# EAGLE design Common_Bluetooth_Control (EAGLE 7.2.0)
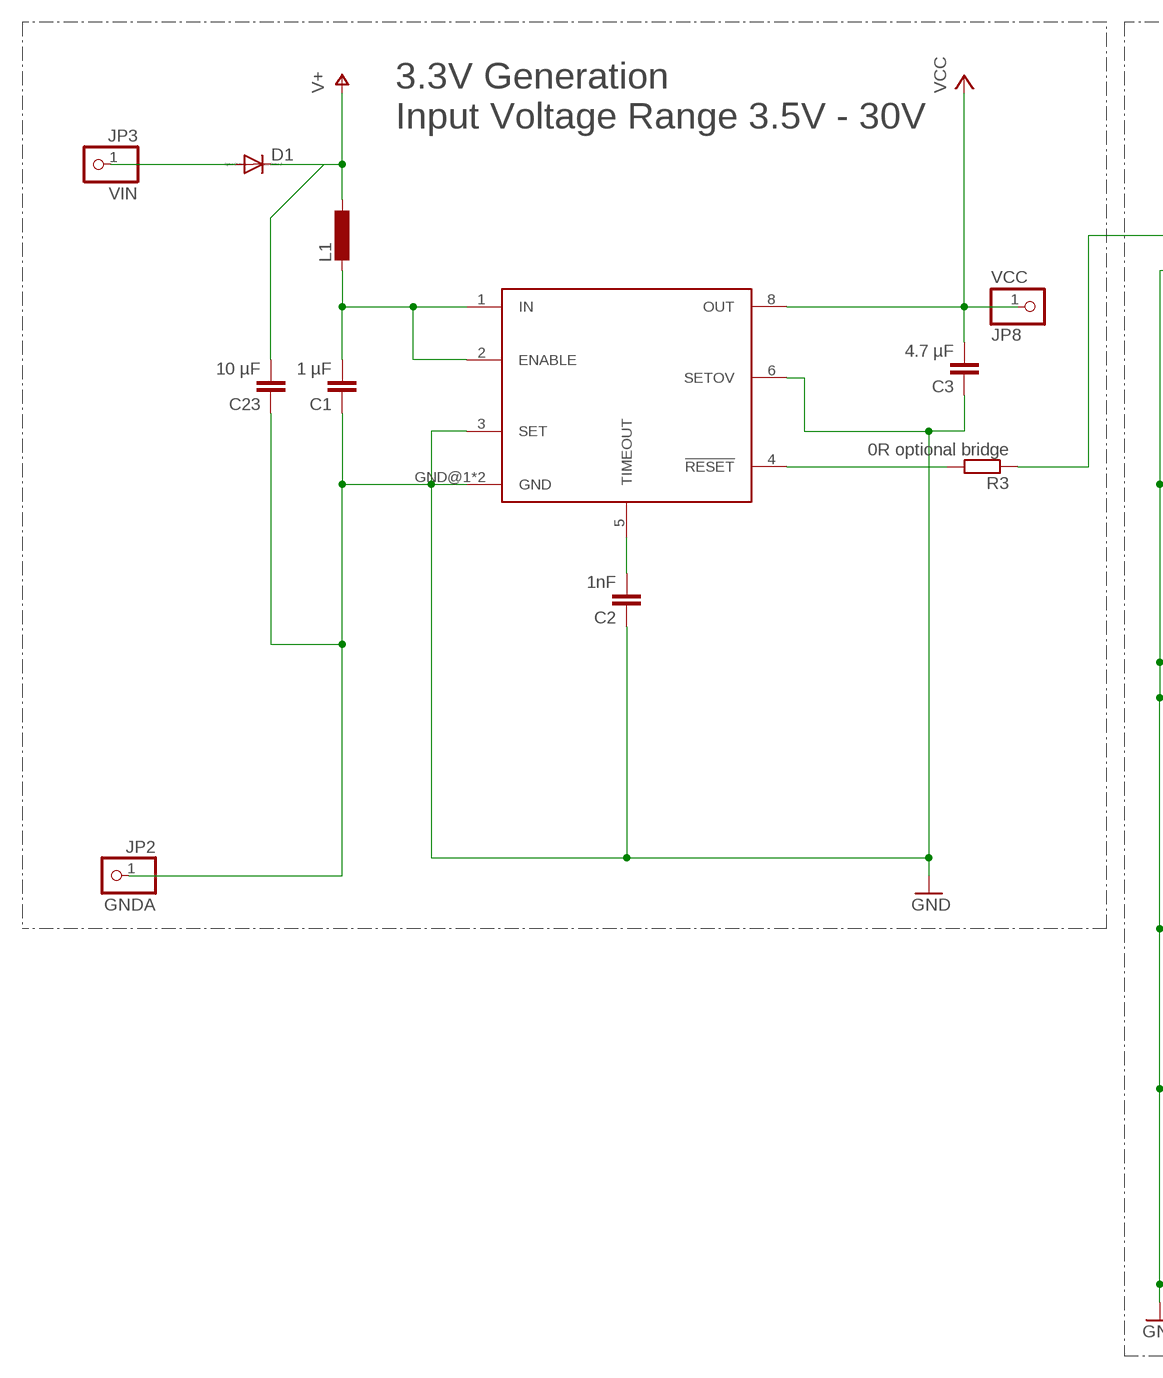
[diagram p0: schematic, sheet 1, part 1 of 2]
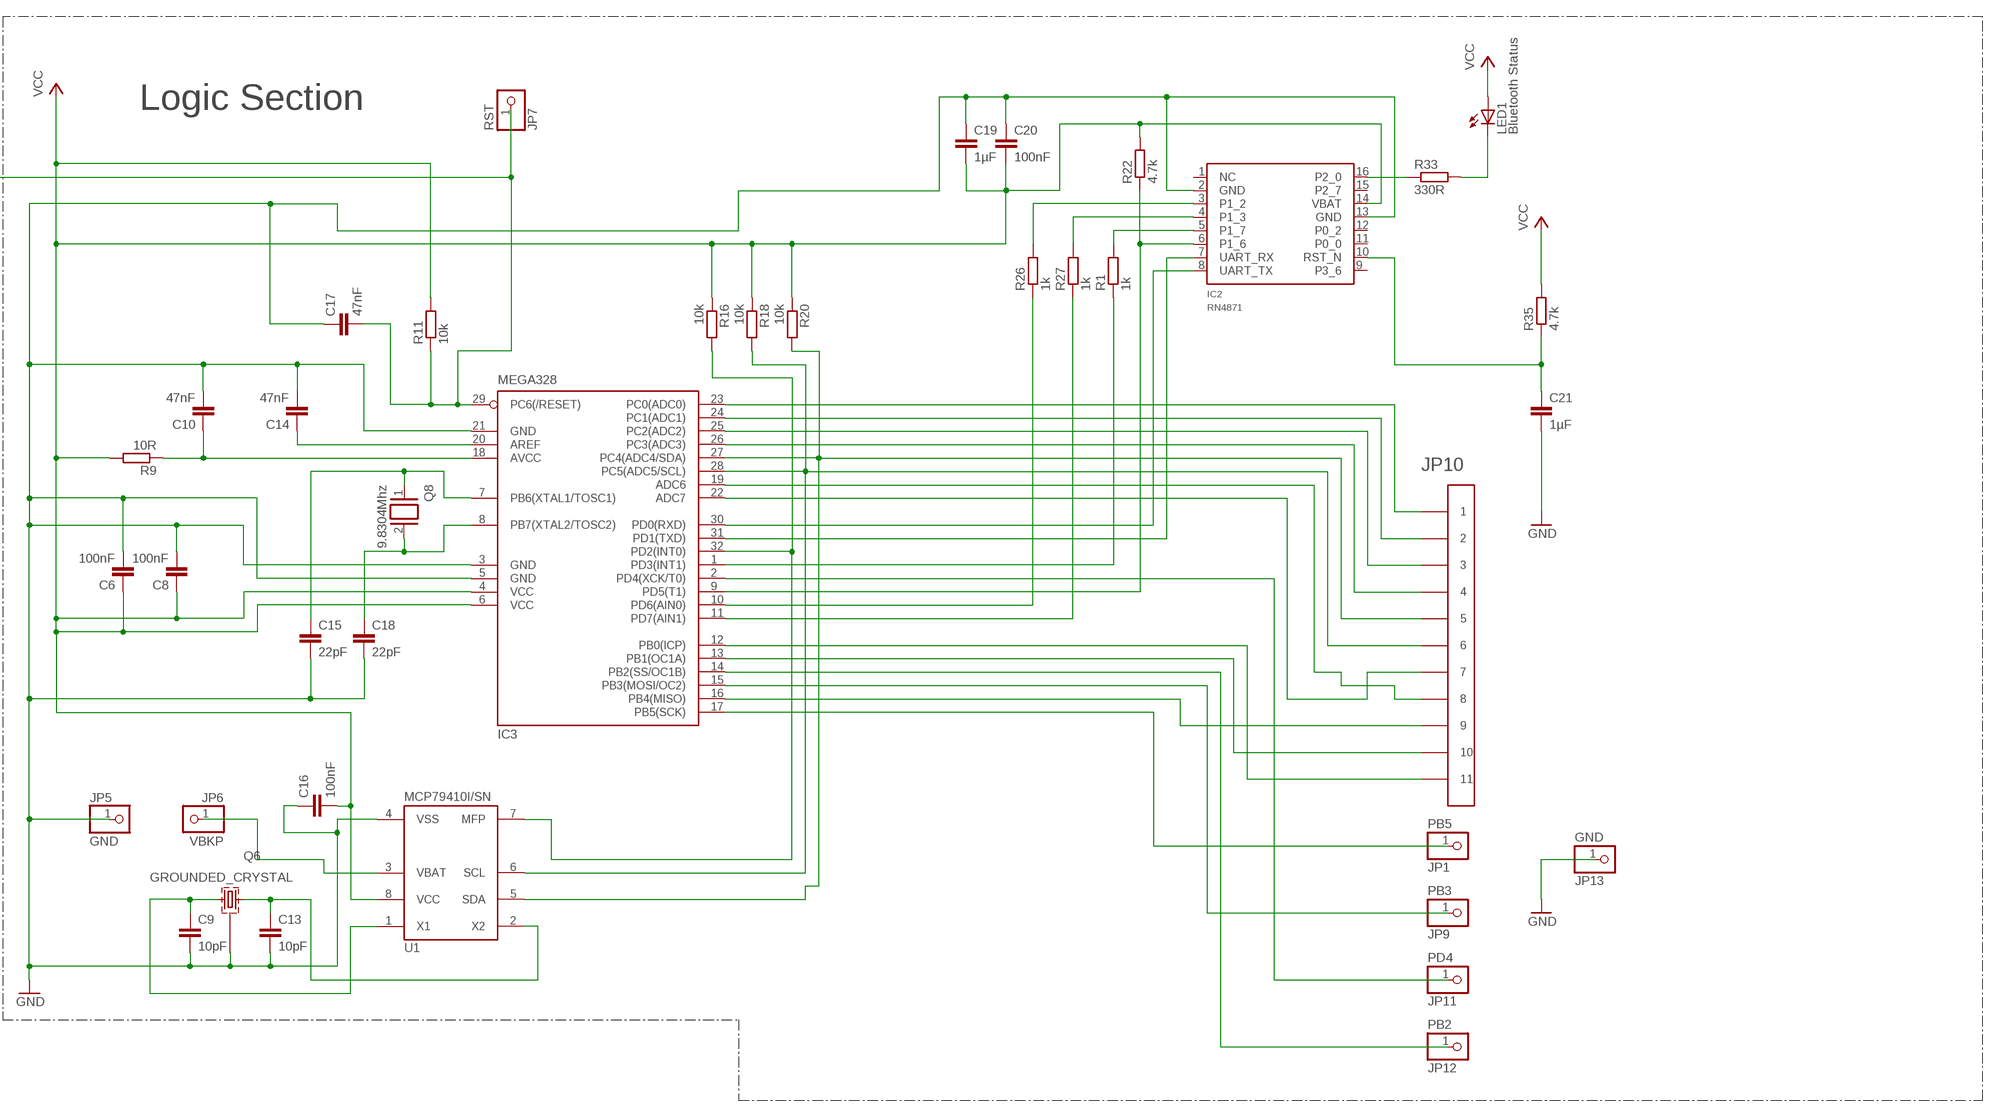
[diagram p1: schematic, sheet 1, part 2 of 2]

## Parts
C1  1 µF  C-EUC1206  [C1206]
C2  1nF  C-EUC0603  [C0603]
C3  4.7 µF  C-EUC1206  [C1206]
C6  100nF  C-EUC0603  [C0603]
C8  100nF  C-EUC0603K  [C0603K]
C9  10pF  C-EUC0603  [C0603]
C10  47nF  C-EUC0603  [C0603]
C13  10pF  C-EUC0603  [C0603]
C14  47nF  C-EUC0603  [C0603]
C15  22pF  C-EUC0805  [C0805]
C16  100nF  C-EUC0603  [C0603]
C17  47nF  C-EUC0603  [C0603]
C18  22pF  C-EUC0805  [C0805]
C19  1µF  C-EUC0603  [C0603]
C20  100nF  C-EUC0603  [C0603]
C21  1µF  C-EUC0603  [C0603]
C23  10 µF  C-EUC1206  [C1206]
D1  DIODE-DO214AC  [DO214AC]
IC1  MAX16910  [SO08]
IC2  RN4871  [RN4871]
IC3  MEGA328  MEGA8-AI  [TQFP32-08]
JP1  PB5  PINHD-1X1  [1X01]
JP2  GNDA  PINHD-1X1  [1X01]
JP3  VIN  PINHD-1X1  [1X01]
JP5  GND  PINHD-1X1  [1X01]
JP6  VBKP  PINHD-1X1  [1X01]
JP7  RST  PINHD-1X1  [1X01]
JP8  VCC  PINHD-1X1  [1X01]
JP9  PB3  PINHD-1X1  [1X01]
JP10  PINHD-1X11-OCT  [1X11_OCT]
JP11  PD4  PINHD-1X1  [1X01]
JP12  PB2  PINHD-1X1  [1X01]
JP13  GND  PINHD-1X1  [1X01]
L1  L-EUL0805  [R0805]
LED1  Bluetooth Status  LEDCHIPLED_0603  [CHIPLED_0603]
Q6  GROUNDED_CRYSTAL  [MS3V-7]
Q8  9.8304Mhz  XTAL/S  [QS]
R1  1k  R-EU_R0603  [R0603]
R3  0R optional bridge  R-EU_R0603  [R0603]
R9  10R  R-EU_R0603  [R0603]
R11  10k  R-EU_R0603  [R0603]
R16  10k  R-EU_R0603  [R0603]
R18  10k  R-EU_R0603  [R0603]
R20  10k  R-EU_R0603  [R0603]
R22  4.7k  R-EU_R0603  [R0603]
R26  1k  R-EU_R0603  [R0603]
R27  1k  R-EU_R0603  [R0603]
R33  330R  R-EU_R0603  [R0603]
R35  4.7k  R-EU_R0603  [R0603]
U1  MCP79410I/SN  [SO8]

## Nets
GND: C1.1 C2.1 C3.1 C6.2 C8.2 C9.2 C10.2 C13.2 C14.2 C15.2 C16.1 C17.1 C18.2 C19.1 C20.1 C21.2 C23.1 IC1.3(SET) IC1.6(SETOV) IC1.GND@1(GND) IC1.GND@2(GND) IC2.2(GND) IC2.13(GND) IC3.3(GND) IC3.5(GND) IC3.21(GND) JP2.1 JP5.1 JP13.1 Q6.GND U1.4(VSS)
N$1: C13.1 Q6.X2 U1.2(X2)
N$2: C21.1 IC2.10(RST_N) R35.1
N$3: IC2.16(P2_0) R33.1
N$4: IC3.32(PD2(INT0)) R16.2 U1.7(MFP)
N$5: C9.1 Q6.X1 U1.1(X1)
N$6: IC2.3(P1_2) R26.2
N$7: LED1.C R33.2
N$8: IC2.8(UART_TX) IC3.30(PD0(RXD))
N$9: IC2.7(UART_RX) IC3.31(PD1(TXD))
N$10: D1.A JP3.1
N$11: C10.1 IC3.18(AVCC) R9.1
N$12: IC3.16(PB4(MISO)) JP10.9
N$13: C14.1 IC3.20(AREF)
N$14: C15.1 IC3.7(PB6(XTAL1/TOSC1)) Q8.1
N$15: JP6.1 U1.3(VBAT)
N$16: C18.1 IC3.8(PB7(XTAL2/TOSC2)) Q8.2
N$17: IC2.4(P1_3) R27.2
N$18: IC3.17(PB5(SCK)) JP1.1
N$19: IC3.11(PD7(AIN1)) R27.1
N$20: IC3.10(PD6(AIN0)) R26.1
N$21: IC2.6(P1_6) IC3.9(PD5(T1)) R22.1
N$22: IC3.28(PC5(ADC5/SCL)) JP10.1 R18.2 U1.6(SCL)
N$23: IC3.27(PC4(ADC4/SDA)) JP10.2 R20.2 U1.5(SDA)
N$24: IC2.5(P1_7) R1.2
N$25: IC3.1(PD3(INT1)) R1.1
N$26: IC3.23(PC0(ADC0)) JP10.5
N$27: IC3.24(PC1(ADC1)) JP10.6
N$28: IC3.25(PC2(ADC2)) JP10.4
N$29: IC3.26(PC3(ADC3)) JP10.3
N$30: IC3.19(ADC6) JP10.8
N$31: IC3.22(ADC7) JP10.7
N$32: IC3.2(PD4(XCK/T0)) JP11.1
N$33: IC3.12(PB0(ICP)) JP10.11
N$34: IC3.13(PB1(OC1A)) JP10.10
N$35: IC3.14(PB2(SS/OC1B)) JP12.1
N$36: C2.2 IC1.5(TIMEOUT)
N$40: IC1.4(!RESET!) R3.2
N$48: C1.2 IC1.1(IN) IC1.2(ENABLE) L1.2
N$80: IC3.15(PB3(MOSI/OC2)) JP9.1
N$86: C17.2 IC3.29(PC6(/RESET)) JP7.1 R3.1 R11.1
V+: C23.2 D1.C L1.1
VCC: C3.2 C6.1 C8.1 C16.2 C19.2 C20.2 IC1.8(OUT) IC2.14(VBAT) IC3.4(VCC) IC3.6(VCC) JP8.1 LED1.A R9.2 R11.2 R16.1 R18.1 R20.1 R22.2 R35.2 U1.8(VCC)
Unconnected: IC2.1(NC) IC2.9(P3_6) IC2.11(P0_0) IC2.12(P0_2) IC2.15(P2_7)

## Notes on the sheet
- Logic Section
- 3.3V Generation
  Input Voltage Range 3.5V - 30V

## Library data of the parts
C1-C3 C6 C8-C10 C13-C21 C23 = resistor:C-EU: CAPACITOR, European symbol
D1 = diode:DIODE-: DIODE
IC1 = max16910:MAX16910: Maxim Integrated MAX16910 Ultra-LowQuiescent Current, Linear Regulator
IC2 = RN4871:RN4871
IC3 = atmel:MEGA8: MICROCONTROLLER 8 Kbytes FLASH, 1 kbytes SRAM, 512 bytes EEPROM, USART, 6-channel 10 bit ADC, 2-channel 8 bit ADC Pin compatible with Atmega48, ATMega88, ATMega168 Source: avr.lbr; MPN: ATMEGA8-16AU; OC_FARNELL: 9171371; OC_NEWARK: 73M8863
JP1-JP3 JP5-JP9 JP11-JP13 = pinhead:PINHD-1X1: PIN HEADER
JP10 = pinheadX:PINHD-1X11-OCT
L1 = Inductance special:L-EU: INDUCTOR, European symbol
LED1 = led:LED: LED OSRAM: - CHIPLED LG R971, LG N971, LY N971, LG Q971, LY Q971, LO R971, LY R971 LH N974, LH R974 LS Q976, LO Q976, LY Q976 LO Q996 - Hyper CHIPLED LW Q18S LB Q993, LB Q99A, LB R99A - SideLED LS A670, LO A670, LY A670, LG A670, LP A670 LB A673, LV A673, LT A673, LW A673 LH A674 LY A675 LS A676, LA A676, LO A676, LY A676, LW A676 LS A679, LY A679, LG A679 - Hyper Micro SIDELED® LS Y876, LA Y876, LO Y876, LY Y876 LT Y87S - SmartLED LW L88C, LW L88S LB L89C, LB L89S, LG L890 LS L89K, LO L89K, LY L89K LS L896, LA L896, LO L896, LY L896 - TOPLED LS T670, LO T670, LY T670, LG T670, LP T670 LSG T670, LSP T670, LSY T670, LOP T670, LYG T670 LG T671, LOG T671, LSG T671 LB T673, LV T673, LT T673, LW T673 LH T674 LS T676, LA T676, LO T676, LY T676, LB T676, LH T676, LSB T676, LW T676 LB T67C, LV T67C, LT T67C, LS T67K, LO T67K, LY T67K, LW E67C LS E67B, LA E67B, LO E67B, LY E67B, LB E67C, LV E67C, LT E67C LW T67C LS T679, LY T679, LG T679 LS T770, LO T770, LY T770, LG T770, LP T770 LB T773, LV T773, LT T773, LW T773 LH T774 LS E675, LA E675, LY E675, LS T675 LS T776, LA T776, LO T776, LY T776, LB T776 LHGB T686 LT T68C, LB T68C - Hyper Mini TOPLED® LB M676 - Mini TOPLED Santana® LG M470 LS M47K, LO M47K, LY M47K Source: http://www.osram.convergy.de LUXEON: - LUMILED® LXK2-PW12-R00, LXK2-PW12-S00, LXK2-PW14-U00, LXK2-PW14-V00 LXK2-PM12-R00, LXK2-PM12-S00, LXK2-PM14-U00 LXK2-PE12-Q00, LXK2-PE12-R00, LXK2-PE12-S00, LXK2-PE14-T00, LXK2-PE14-U00 LXK2-PB12-K00, LXK2-PB12-L00, LXK2-PB12-M00, LXK2-PB14-N00, LXK2-PB14-P00, LXK2-PB14-Q00 LXK2-PR12-L00, LXK2-PR12-M00, LXK2-PR14-Q00, LXK2-PR14-R00 LXK2-PD12-Q00, LXK2-PD12-R00, LXK2-PD12-S00 LXK2-PH12-R00, LXK2-PH12-S00 LXK2-PL12-P00, LXK2-PL12-Q00, LXK2-PL12-R00 Source: www.luxeon.com KINGBRIGHT: KA-3528ASYC Source: www.kingbright.com
Q6 = crystal:GROUNDED_CRYSTAL
Q8 = special:XTAL/S: CRYSTAL
R1 R3 R9 R11 R16 R18 R20 R22 R26 R27 R33 R35 = resistor:R-EU_: RESISTOR, European symbol
U1 = _hhn_MCP7941X:MCP7941*?: Microchip MCP79410 / MCP79411 / MCP79412 I²C Real Time CLock/Calendar with Unique ID Rev. 5.0.0 as of 2013-10-23, for EAGLE 5+ Changelog 5.0.0 (initial) MCP79410XI/YY X: Unique ID 0: blank 1: EUI-48 2: EUI-96 I: Temperature Range (Industrial) /YY: Package /MS: MSOP8_.65 (8-Lead Micro Small Outline Package, 0.65mm pitch) /SN: SOIC8 (8-Lead Small Outline [Narrow], 3.9mm body) /ST: TSSOP8 (8-Lead Thin Schrink Small Outline, 4.4mm body) Source: http://www.microchip.com Author: Dipl.-Ing. FH Rainer Bayer Heilbronn University HHN http://www.hs-heilbronn.de/rainer.bayer · rainer.bayer@hs-heilbronn.de Engineering office ing-rb: http://www.ing-rb.de/ · eagle@ing-rb.de Lectureship dozent-rb: http://www.dozent-rb.de/ · eagle@dozent-rb.de

## Board
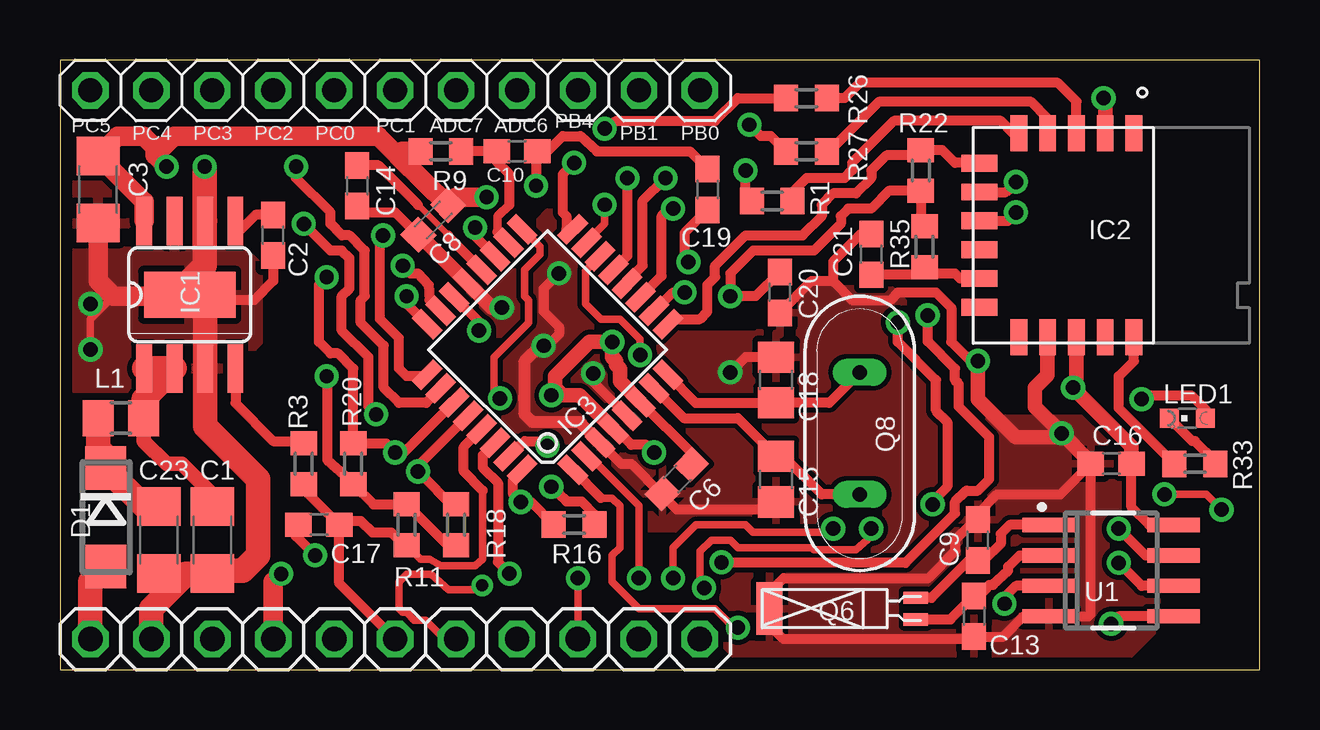
[diagram p2: board, top side]
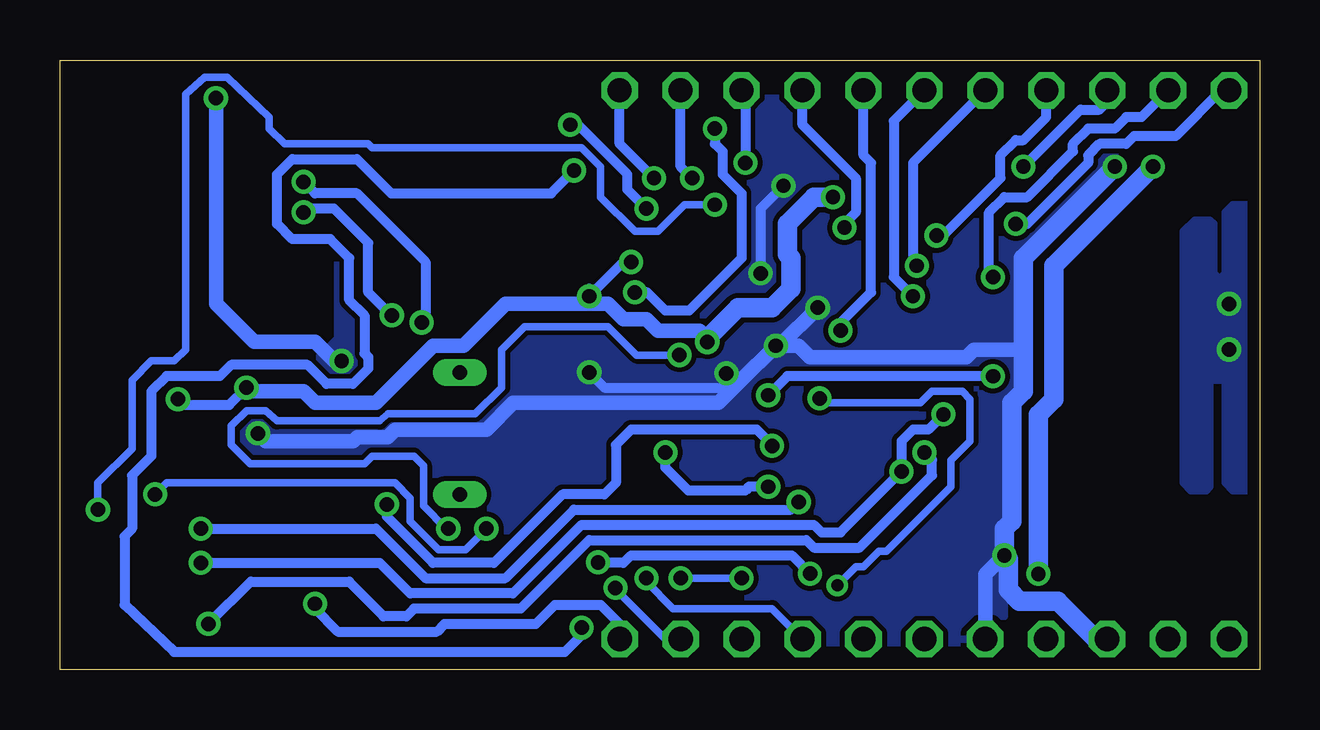
[diagram p3: board, bottom side, seen from below]

Size 50 x 25.4 mm. Coordinates in mm from the lower left corner, seen from the top.
Outline: 0,0 50,0 50,25.4 0,25.4 0,0
Copper layers (1*16): Top 0.035mm / dielectric 1.5mm / Bottom 0.035mm
Design rules "default *": minimum track width 10mil, minimum drill 19mil, track to track 8mil, track to pad 8mil, pad to pad 8mil, via to via 8mil, smd to smd 8mil, copper to edge 20mil, drill to drill 8mil, minimum pad ring 10mil, minimum via ring 8mil, stop-mask expansion 4mil, vias tented up to drill 0mil, thermal gap 10mil

### Footprints (pad centres in the part's own frame; a part is rotated, then mirrored left to right if it is on the bottom)
C1206 = smd 1.6 x 1.8: 1 -1.4,0; 2 1.4,0
C0603 = smd 1.1 x 1: 1 -0.85,0; 2 0.85,0
C0603K = smd 1.05 x 1.08: 1 -0.875,0; 2 0.875,0
C0805 = smd 1.3 x 1.5: 1 -0.95,0; 2 0.95,0
DO214AC = smd 1.8 x 1.7: A 2.05,0; C -2.05,0
SO08 = smd 0.66 x 2.032: 1 -1.905,-3.073; 2 -0.635,-3.073; 3 0.635,-3.073; 4 1.905,-3.073; 5 1.905,3.073; 6 0.635,3.073; 8 -1.905,3.073; GND@1 -0.635,3.073 | smd 3.81 x 1.93: GND@2 0,0
RN4871 = smd 1.5 x 0.7: 1 -4.25,0.95; 2 -4.25,-0.25; 3 -4.25,-1.45; 4 -4.25,-2.65; 5 -4.25,-3.85; 12 4.25,-3.85; 13 4.25,-2.65; 14 4.25,-1.45; 15 4.25,-0.25; 16 4.25,0.95 | smd 0.7 x 1.5: 6 -3,-5.5; 7 -1.8,-5.5; 8 -0.6,-5.5; 9 0.6,-5.5; 10 1.8,-5.5; 11 3,-5.5
TQFP32-08 = smd 1.27 x 0.559: 1 -4.293,2.8; 2 -4.293,2; 3 -4.293,1.2; 4 -4.293,0.4; 5 -4.293,-0.4; 6 -4.293,-1.2; 7 -4.293,-2; 8 -4.293,-2.8; 17 4.293,-2.8; 18 4.293,-2; 19 4.293,-1.2; 20 4.293,-0.4; 21 4.293,0.4; 22 4.293,1.2; 23 4.293,2; 24 4.293,2.8 | smd 0.559 x 1.27: 9 -2.8,-4.293; 10 -2,-4.293; 11 -1.2,-4.293; 12 -0.4,-4.293; 13 0.4,-4.293; 14 1.2,-4.293; 15 2,-4.293; 16 2.8,-4.293; 25 2.8,4.293; 26 2,4.293; 27 1.2,4.293; 28 0.4,4.293; 29 -0.4,4.293; 30 -1.2,4.293; 31 -2,4.293; 32 -2.8,4.293
1X01 = drill 1.016 octagon: 1 0,0
1X11_OCT = drill 1 octagon: 1 -12.7,0; 2 -10.16,0; 3 -7.62,0; 4 -5.08,0; 5 -2.54,0; 6 0,0; 7 2.54,0; 8 5.08,0; 9 7.62,0; 10 10.16,0; 11 12.7,0
R0805 = smd 1.3 x 1.5: 1 -0.95,0; 2 0.95,0
CHIPLED_0603 = smd 0.8 x 0.8: A 0,-0.75; C 0,0.75
MS3V-7 = smd 1.067 x 2.184: GND -4.4,0 | smd 1.016 x 0.508: X1 1.7,0.45; X2 1.7,-0.45
QS = drill 0.61 long: 1 -2.54,0; 2 2.54,0
R0603 = smd 1 x 1.1: 1 -0.85,0; 2 0.85,0
SO8 = smd 0.6 x 2.2: 1 -1.905,-2.6; 2 -0.635,-2.6; 3 0.635,-2.6; 4 1.905,-2.6; 5 1.905,2.6; 6 0.635,2.6; 7 -0.635,2.6; 8 -1.905,2.6

### Placement (x,y rotation side)
C1  6.35,5.4 90 top
C2  8.89,18.1 90 top
C3  1.59,20 90 top
C6  25.72,7.94 225 top
C8  15.56,18.73 225 top
C9  38.25,5.4 90 top
C10  19.05,21.59 0 top
C13  38.1,2.22 270 top
C14  12.38,20.16 270 top
C15  29.84,7.94 270 top
C16  43.81,8.57 0 top
C17  10.79,6.03 0 top
C18  29.84,12.06 90 top
C19  26.99,20 270 top
C20  30,15.72 90 top
C21  33.81,17.3 90 top
C23  4.13,5.4 90 top
D1  1.91,6.35 270 top
IC1  5.41,15.62 0 top
IC2  43.81,18.1 270 top
IC3  20.32,13.34 135 top
JP1  16.51,1.27 0 top
JP2  3.81,1.27 0 top
JP3  1.27,1.27 0 top
JP5  11.43,1.27 0 top
JP6  26.67,1.27 0 top
JP7  13.97,1.27 0 top
JP8  8.89,1.27 0 top
JP9  19.05,1.27 0 top
JP10  13.97,24.13 0 top
JP11  21.59,1.27 0 top
JP12  24.13,1.27 0 top
JP13  6.35,1.27 0 top
L1  2.54,10.48 0 top
LED1  46.99,10.48 90 top
Q6  33.97,2.54 0 top
Q8  33.34,9.84 90 top
R1  29.69,19.53 0 top
R3  10.16,8.57 90 top
R9  15.88,21.59 180 top
R11  14.45,6.03 90 top
R16  21.43,6.05 180 top
R18  16.51,6.03 90 top
R20  12.22,8.57 90 top
R22  35.88,20.8 270 top
R26  31.11,23.81 0 top
R27  31.11,21.59 0 top
R33  47.31,8.57 0 top
R35  36.04,17.62 90 top
U1  43.81,4.13 270 top

### Tracks (layer width: path | path; a pad name or v marks a point on that pad's centre or on a via)
GND  (via drill 0.6)
  Top 0.305: v1.27,13.34 1.27,14.61 2.22,15.56
  Top 0.406: C17.1 9.84,5.93 9.84,5.56 v10.64,4.76 | C15.2 29.52,6.67 25.72,6.67 25.12,7.27 C6.2 25.05,7.34 23.81,8.57 23.39,8.57 IC3.3 | C18.2 28.57,13.02 v27.94,12.38 | 38.1,6.35 C9.2 38.25,6.5 39.05,7.3 41.7,7.3 C16.1 | C16.1 42.86,8.57 | C21.2 33.39,18.15 32.23,16.99 32.23,16.19 | C16.1 42.97,2.33 42.86,2.22 U1.4 40.16,2.22 39.31,1.37 C13.2 38,1.27 30.16,1.27 29.57,1.86 Q6.GND 29.57,3.22 30.16,3.81 36.2,3.81 37.31,4.92 37.31,5.4 38.1,6.19 38.26,6.19 38.26,6.35 | C2.1 8.89,16.19 8.1,15.4 5.63,15.4 IC1.GND@2 | C20.1 31.33,16.19 32.23,16.19 | C19.1 26.25,21.59 22.38,21.59 21.69,22.23 20.95,22.23 20.32,21.59 C10.2 19.84,21.53 v19.84,20.16 | v20.8,16.51 20.16,15.88 20.16,14.92 20.8,14.29 20.8,13.97 20.32,13.49 v20.16,13.49 | C14.2 12.64,19.05 13.97,19.05 14.91,18.11 C8.2 | 32.23,16.19 33.02,15.4 34.61,15.4 34.92,15.72 36.51,15.72 37.15,15.08 37.15,13.65 37.94,12.86 v38.26,12.86 | IC3.5 22.23,12 v22.23,12.34
  Top 0.508: IC3.3 21.64,10.32 19.68,10.32 19.37,10.64 19.37,12.86 20,13.49
  Top 0.61: C8.2 14.96,18.13 IC3.21 18.01,15.08 v18.41,15.08 | IC2.13 41.16,12.27 40.64,11.75 40.64,10.95 v41.75,9.84 | v38.26,12.86 38.26,11.27 39.85,9.68 41.59,9.68 v41.75,9.84 | 20,13.49 v20.16,13.49 | 42.86,8.57 42.86,8.73 v41.75,9.84 | IC2.2 43.56,23.75 v43.5,23.81
  Top 0.813: C3.1 1.59,16.19 2.22,15.56 5.35,15.56 IC1.GND@2
  Top 1.016: JP2.1 3.81,2.54 5.08,3.81 | 5.08,3.81 4.32,3.81 C23.1 | 5.08,3.81 5.27,4 C1.1 6.48,4.13 7.62,4.13 8.26,4.76 8.26,7.94 6.04,10.15 IC1.3 6.04,14.99 IC1.GND@2 5.41,16.2 6.03,16.83 6.03,18.68 | 6.03,18.68 IC1.6 | v6.03,20.95 6.03,18.68
  Bottom 0.406: v27.94,12.38 27.3,11.75 21.91,11.75 21.67,11.99 21.83,11.99 v22.23,12.34 | v19.84,20.16 20.8,19.21 v20.8,16.51
  Bottom 0.61: 10.95,4.45 v10.64,4.76 11.43,3.97 JP5.1 | 9.84,13.34 11.91,13.34 12.22,13.02 18.73,13.02 19.21,13.49 v20.16,13.49 | v20.16,13.49 21.67,11.99 22.54,11.11 31.11,11.11 32.23,10 36.04,10 36.35,9.68 37.62,9.68 37.78,9.53 41.43,9.53 v41.75,9.84 | v20.16,13.49 20,13.49 v18.41,15.08 | v43.5,23.81 43.5,15.24 41.91,13.65 39.37,13.65 38.58,12.86 v38.26,12.86
  Bottom 0.813: JP13.1 6.83,1.27 8.41,2.86 10,2.86 10.48,3.33 10.48,4.6 v10.64,4.76 10.64,5.87 10.32,6.19 10.32,11.11 9.84,11.59 9.84,13.34 9.84,17.14 v6.03,20.95
  other vias: 1.27,15.24
  pour Top: 0,18.73 0,11.75 6.35,11.75 8.26,13.65 8.26,16.83 7.62,17.46 5.08,17.46 1.91,20.64 0.32,20.64 0,20.32
  pour Top: 20,18.73 20,18.57 14.76,13.34 15.4,13.34 22.86,5.87 27.46,5.87 28.42,4.92 29.69,3.65 35.4,3.65 36.99,5.24 36.99,13.49 34.61,15.88 30.96,15.88 29.05,13.97 25.88,13.97 20.8,19.05 20.32,19.05
  pour Top: 27.46,4.76 27.46,1.27 28.26,0.48 44.45,0.48 45.72,1.75 45.72,6.83 44.61,7.94 44.61,8.73 42.86,10.48 32.23,10.48 27.46,5.71
  pour Bottom: 6.03,20.8 9.84,16.99 9.84,11.43 10.64,10.64 10.64,2.22 11.75,1.11 45.88,1.11 46.67,1.91 46.67,5.56 38.42,13.81 38.42,21.75 36.35,23.81 7.46,23.81 6.03,22.38
  pour Bottom: 0,18.73 0,7.94 0.48,7.46 1.11,7.46 1.43,7.78 1.43,12.06 2.06,12.06 2.06,7.62 2.22,7.46 2.86,7.46 3.17,7.78 3.17,18.26 2.7,18.73 2.06,18.73 1.91,18.57 1.91,16.51 1.75,16.35 1.59,16.35 1.43,16.51 1.43,19.05 1.11,19.37 0.32,19.37 0,19.05
N$1
  Top 0.406: Q6.X2 37.12,2.09 C13.1 38.31,3.07 38.73,3.53 38.89,3.53 39.53,4.13 39.53,4.29 40.01,4.76 U1.2
N$2
  Top 0.406: C21.1 35.72,16.45 R35.1 36.3,16.51 37.31,16.51 37.52,16.3 IC2.10
N$3
  Top 0.406: R33.1 44.13,10.9 44.13,12.22 44.77,12.86 IC2.16
N$4  (via drill 0.6)
  Top 0.406: U1.7 45.24,4.76 v44.13,5.87 | IC3.32 18.89,7.94 18.89,7.3 v19.21,6.99 19.63,6.99 R16.2
  Bottom 0.406: v44.13,5.87 36.83,5.87 34.77,3.81 31.43,3.81 28.57,6.67 19.53,6.67 v19.21,6.99
N$5
  Top 0.406: U1.1 39.59,6.03 39.21,5.66 39.21,5.24 38.52,4.55 C9.1 37.88,4.55 36.33,2.99 Q6.X1
N$6
  Top 0.406: IC2.3 42.37,23.68 41.59,24.45 33.34,24.45 32.7,23.81 R26.2
N$7
  Top 0.406: R33.2 48.16,8.68 47.31,9.53 47.19,9.53 LED1.C
N$8  (via drill 0.6)
  Top 0.406: IC3.30 17.62,8.94 17.62,8.41 18.26,7.78 18.26,4.48 v18.73,4 | v36.17,14.76 36.17,13.68 37.31,12.54 37.31,12.06 37.47,11.91 37.47,10.95 38.73,9.68 38.73,7.94 38.26,7.46 37.78,7.46 37.31,6.99 37.31,6.51 35.24,4.45 27.6,4.45 v27.57,4.47 | IC2.8 39.49,18.7 v39.85,19.05
  Bottom 0.406: v36.17,14.76 36.19,14.76 37.15,15.72 37.15,17.78 38.58,19.21 39.69,19.21 v39.85,19.05 | v27.57,4.47 27.55,4.45 26.51,4.45 26.19,4.76 19.49,4.76 v18.73,4
N$9  (via drill 0.6)
  Top 0.406: IC3.31 19.18,9.37 19.21,9.37 19.37,9.53 20.12,9.53 v20.32,9.32 | v34.92,14.46 34.92,13.65 36.51,12.06 36.51,10.79 36.99,10.32 36.99,7.62 36.37,7 v36.37,6.88 | IC2.7 39.42,19.9 v39.85,20.32
  Bottom 0.406: v34.92,14.46 34.77,14.62 34.77,16.99 37.62,19.84 39.37,19.84 v39.85,20.32 | v20.32,9.32 20.32,9.37 20.95,10 26.19,10 26.83,9.37 26.83,7.78 27.3,7.3 29.05,7.3 31.91,4.45 34.45,4.45 36.37,6.37 v36.37,6.88
N$10
  Top 1.016: JP3.1 1.27,3.67 D1.A
N$11
  Top 0.356: 18.24,18.23 18.24,18.89 18.73,19.37
  Top 0.406: IC3.18 18.24,18.23 | 18.73,19.37 18.73,20.64 18.2,21.17 C10.1 R9.1
N$12  (via drill 0.6)
  Top 0.406: 21.59,18.57 IC3.16 21.11,18.35 21.11,18.89 20.95,19.05 20.95,20.64 v21.43,21.11
  Bottom 0.406: JP10.9 21.43,23.97 v21.43,21.11
N$13
  Top 0.254: 16.19,18.1 14.92,19.37
  Top 0.406: IC3.20 16.19,18.03 16.19,18.1 | 14.92,19.37 13.28,21.01 C14.1
N$14
  Top 0.406: IC3.7 26.01,10.48 28.26,10.48 C15.1 30.16,8.89 31.75,7.3 Q8.1
N$15  (via drill 0.6)
  Top 0.406: U1.3 39.85,3.49 39.37,3.02 v39.37,2.74
  Bottom 0.406: v39.37,2.74 39.37,2.54 38.42,1.59 34.29,1.59 33.97,1.91 30.16,1.91 29.37,2.7 27.46,2.7 26.67,1.91 JP6.1
N$16
  Top 0.406: IC3.8 26.5,11.12 C18.1 32.07,11.12 Q8.2
N$17
  Top 0.406: IC2.4 41.16,22.97 40.48,23.65 34.13,23.65 32.07,21.59 R27.2
N$18  (via drill 0.5, 0.6)
  Top 0.305: 19.27,18.35 IC3.17 20,17.61 20,17.3 19.37,16.67 19.37,15.56 19.53,15.4 19.53,14.45 18.1,13.02 18.1,11.54 v18.34,11.3 | JP1.1 16.03,1.27 15.24,2.06 14.76,2.06 14.45,2.39 14.29,2.39 14.13,2.54 14.13,3.65 14.45,3.97 15.47,3.97 16.2,3.33 17.43,3.33 v17.6,3.5
  Bottom 0.305: v17.6,3.5 16.83,4.29 16.51,4.29 15.88,4.92 15.56,4.92 12.86,7.62 12.86,8.73 12.06,9.53 12.06,11.27 12.38,11.59 13.65,11.59 14.13,11.11 18.15,11.11 v18.34,11.3
N$19  (via drill 0.6)
  Top 0.406: IC3.11 25.08,16.4 25.08,18.89 25.4,19.21 v25.56,19.21 | R27.1 29.63,22.23 29.21,22.23 v28.73,22.7
  Bottom 0.406: v25.56,19.21 26.35,20 26.35,20.64 28.42,22.7 v28.73,22.7
N$20  (via drill 0.6)
  Top 0.406: IC3.10 24.8,14.96 25.56,15.72 v26.04,15.72 | R26.1 28.26,23.81 27.3,22.86 23.18,22.86 22.86,22.54 v22.7,22.54
  Bottom 0.406: v26.04,15.72 25.53,15.72 IC3.10 23.78,14.96 21.59,17.14 21.59,19.84 22.38,20.64 22.38,21.59 22.7,21.91 v22.7,22.54
N$21
  Top 0.406: IC2.6 38.3,21.11 37.31,21.11 36.77,21.65 R22.1 35.66,21.43 34.45,21.43 33.81,20.8 33.81,20.48 33.18,19.84 32.23,19.84 31.75,19.37 31.75,18.89 30.96,18.1 28.57,18.1 27.3,16.83 27.3,16.35 26.99,16.03 26.99,14.92 26.67,14.61 25.56,14.61 IC3.9
N$22  (via drill 0.6)
  Top 0.406: IC3.28 14.92,8.5 v14.92,8.26 16.51,6.67 R18.2 | U1.6 45.09,3.49 v44.13,4.45 | v10.16,18.57 11.27,17.46 11.75,17.46 12.06,17.14 12.06,15.88 11.75,15.56 11.75,14.13 12.86,13.02 12.86,10.95 v13.18,10.64
  Bottom 0.406: v44.13,4.45 36.67,4.45 35.4,3.17 31.11,3.17 28.26,6.03 18.57,6.03 18.26,5.71 17.46,5.71 v14.92,8.26 14.92,9.53 14.45,10 13.81,10 v13.18,10.64 | JP10.1 1.59,24.13 3.49,22.23 5.24,22.23 5.56,21.91 6.67,21.91 7.14,21.43 7.14,21.11 9.68,18.57 v10.16,18.57
N$23  (via drill 0.6)
  Top 0.406: IC3.27 14.34,9.05 v13.97,9.05 13.6,9.42 R20.2 12.22,12.54 11.59,13.18 11.27,13.18 10.79,13.65 10.79,16.03 v11.11,16.35 | U1.5 44.13,2.22 v43.81,1.91
  Bottom 0.406: v13.97,9.05 13.65,8.73 13.65,8.1 16.67,5.08 18.57,5.08 18.89,5.4 27.94,5.4 30.8,2.54 35.24,2.54 35.56,2.22 36.51,2.22 36.67,2.38 37.94,3.67 42.05,3.67 v43.81,1.91 | JP10.2 4.92,23.02 5.56,23.02 6.03,22.54 7.14,22.54 7.78,21.91 7.78,21.59 9.68,19.68 10.64,19.68 11.27,19.05 11.27,16.51 v11.11,16.35
N$24
  Top 0.406: IC2.5 39.72,22.35 39.21,22.86 34.77,22.86 33.02,21.11 33.02,20.8 32.7,20.48 31.11,20.48 30.54,19.9 R1.2
N$25  (via drill 0.6)
  Top 0.305: 22.55,7.14 23.02,7.14 23.34,6.83 23.34,5.08 23.02,4.76 23.02,3.65 24.13,2.54 27.3,2.54 28.1,1.75 v28.26,1.75
  Top 0.406: R1.1 28.57,19.79 v28.57,20.8 | 22.55,7.14 IC3.1
  Bottom 0.406: v28.57,20.8 29.53,19.84 36.2,19.84 37.62,21.27 40.32,21.27 40.96,20.64 40.96,18.57 40.32,17.94 38.73,17.94 37.94,17.14 37.94,15.4 37.31,14.76 37.31,13.18 37.15,13.02 37.15,12.54 37.78,11.91 38.89,11.91 39.69,12.7 42.86,12.7 43.34,12.22 45.56,12.22 46.2,11.59 46.2,8.89 46.99,8.1 46.99,5.87 47.31,5.56 47.31,2.7 45.24,0.74 28.95,0.74 28.26,1.43 v28.26,1.75
N$26  (via drill 0.6)
  Top 0.406: v14.29,16.83 14.61,16.51 14.92,16.51 15.37,16.03 15.4,15.4 15.84,14.96 IC3.23
  Bottom 0.406: JP10.5 14.45,21.11 14.45,16.99 v14.29,16.83
N$27  (via drill 0.6)
  Top 0.406: IC3.24 14.45,15.24 v14.45,15.56
  Bottom 0.406: JP10.6 15.24,22.86 15.24,16.35 v14.45,15.56
N$28  (via drill 0.6)
  Top 0.406: IC3.25 15.25,12.22 14.45,12.22 14.13,12.54 14.13,13.81 13.34,14.61 13.34,17.96 v13.46,18.09
  Bottom 0.406: JP10.4 8.89,23.02 9.84,22.07 10.16,22.07 10.79,21.43 10.79,20.48 13.19,18.09 v13.46,18.09
N$29  (via drill 0.6)
  Top 0.406: IC3.26 15.27,11.11 14.13,11.11 13.49,11.75 13.49,13.49 12.54,14.45 12.54,15.4 12.7,15.56 12.7,17.46 12.06,18.1 11.75,18.1 11.27,18.57 11.27,19.05 9.84,20.48 v9.84,20.95
  Bottom 0.406: v9.84,20.95 7.46,23.34 6.67,23.34 6.35,23.65 JP10.3
N$30  (via drill 0.6)
  Top 0.406: IC3.19 17.3,18.05 v17.3,18.41
  Bottom 0.406: JP10.8 19.05,22.7 16.83,20.48 16.83,19.05 17.3,18.57 v17.3,18.41
N$31  (via drill 0.6)
  Top 0.406: IC3.22 17.46,14.49 v17.46,14.13
  Bottom 0.406: JP10.7 16.51,21.43 16.19,21.11 16.19,15.72 17.46,14.45 v17.46,14.13
N$32  (via drill 0.6)
  Top 0.305: IC3.2 22.07,8.88 24.13,6.83 v24.13,3.81 | v21.59,3.81 JP11.1
  Bottom 0.305: v24.13,3.81 v21.59,3.81
N$33  (via drill 0.6)
  Top 0.406: IC3.12 23.64,16.18 24.29,16.83 24.29,19.53 v25.24,20.48
  Bottom 0.406: v25.24,20.48 26.67,21.91 JP10.11
N$34  (via drill 0.6)
  Top 0.406: IC3.13 23.65,17.23 v23.65,20.48
  Bottom 0.406: v23.65,20.48 24.13,20.95 JP10.10
N$35  (via drill 0.6)
  Top 0.305: IC3.14 21.91,16.62 21.91,15.24 22.54,14.61 23.34,14.61 24.18,13.76 v24.18,13.11 | v33.81,5.87 33.81,5.56 33.18,5 31.43,5 31.27,5.08 28.26,5.08 27.94,5.4 27.15,5.4 26.67,4.92 26.67,3.58 v26.85,3.4
  Bottom 0.305: v24.18,13.11 25.96,13.11 27.15,14.29 30.64,14.29 31.59,13.34 31.59,11.75 32.7,10.67 36.32,10.67 36.67,10.36 40.96,10.36 41.43,10.79 42.23,10.79 42.86,10.16 42.86,9.37 42.07,8.57 37.31,8.57 36.99,8.89 35.24,8.89 34.85,8.5 34.85,6.83 33.9,5.87 v33.81,5.87 | JP12.1 24.77,1.27 26.85,3.35 v26.85,3.4
N$36
  Top 0.406: C2.2 8.15,18.95 7.3,18.1 7.3,18.68 IC1.5
N$40
  Top 0.406: IC1.4 7.32,11.1 8.89,9.53 10.06,9.53 R3.2
N$48
  Top 0.61: C1.2 6.35,7.3 5.08,8.57 4.45,8.57 3.49,9.53 L1.2
  Top 1.016: L1.2 3.49,11.26 IC1.2 IC1.1
N$80  (via drill 0.6)
  Top 0.305: IC3.15 21.94,17.81 22.7,18.57 v22.7,19.37 | v25.56,3.81 25.56,5.08 26.51,6.03 28.57,6.03 28.89,5.71 32.07,5.71 v32.23,5.87 | v46.04,7.3 47.78,7.3 v48.42,6.67
  Bottom 0.305: v22.7,19.37 23.97,19.37 25.08,18.26 26.04,18.26 27.46,19.68 27.46,20.95 28.26,21.75 36.99,21.75 37.15,21.91 40.64,21.91 41.27,22.54 41.27,23.02 43.02,24.69 43.97,24.69 44.77,23.97 44.77,13.34 45.24,12.86 46.2,12.86 46.99,12.06 46.99,9.21 48.42,7.78 v48.42,6.67 48.26,6.83 | v25.56,3.81 25.56,3.65 24.45,2.54 20.32,2.54 JP9.1 | v32.23,5.87 33.1,5 34.21,5 35.4,6.19 35.4,7.14 36.04,7.78 45.56,7.78 v46.04,7.3
N$86
  Top 0.305: R11.1 15.03,4.6 15.4,4.6 15.88,4.32 17.3,4.32 17.62,4.6 17.62,7.46
  Top 0.406: C17.2 11.64,5.82 | R3.1 10.16,7.52 C17.2 | C17.2 11.8,6.19 12.54,6.19 13.02,5.71 13.81,5.71 14.34,5.18 R11.1 | IC3.29 16.83,9.28 16.83,8.26 17.62,7.46 | JP7.1 11.64,3.6 C17.2
V+
  Top 1.016: C23.2 3.51,6.8 D1.C 1.91,8.89 1.59,9.21 L1.1
VCC  (via drill 0.6)
  Top 0.406: IC3.6 26.32,9.03 C6.1 | U1.8 45.4,6.03 44.66,6.77 C16.2 44.66,8.68 | R35.2 35.88,18.63 R22.2 34.55,19.95 33.81,19.21 32.86,19.21 32.54,18.89 32.54,18.57 31.43,17.46 28.89,17.46 27.94,16.51 v27.94,15.56 29,15.56 C20.2 | v11.11,12.22 11.15,12.19 11.15,8.73 12.22,7.78 R20.1 13.06,6.88 R11.2 16.15,5.18 R18.1 | v24.77,9.05 24.45,9.37 23.81,9.37 23.16,10.02 IC3.4 | C19.2 26.04,18.2 26.04,17.14 v26.19,16.99 | v20.48,7.62 21.11,7.01 21.75,7.01 22.28,6.45 R16.1 | v45.09,11.27 45.24,11.43 47.15,11.43 47.74,10.84 LED1.A
  Top 0.61: IC3.4 21.66,11.43 20.95,11.43 20.72,11.67 | 20.72,11.67 20.64,11.75 20.64,12.22 22.07,13.65 v23.02,13.65 23.02,13.02 23.18,12.86 23.18,12.7 23.34,12.54 23.34,12.02 IC3.6 | v20.48,11.43 20.72,11.67 | 44.66,8.68 44.66,9.31 v42.23,11.75 42.37,11.88 IC2.14
  Top 0.813: IC1.8 3.5,19.48 C3.2 2.41,22.23 3.49,22.23 3.97,21.75 3.97,21.43 | 3.97,21.43 4.76,22.23 13.27,22.23 14.1,21.4 | 14.1,21.4 C8.1 16.51,19.68 v17.78,19.68 | R9.2 14.29,21.59 14.1,21.4 | JP8.1 8.89,3.65 v9.22,3.99 | v4.45,20.95 3.97,21.43
  Bottom 0.406: v24.77,9.05 24.77,8.41 23.81,7.46 21.43,7.46 21.27,7.62 v20.48,7.62 | 28.42,15.24 28.1,15.56 v27.94,15.56 | 27.94,15.88 v27.94,15.56 | v11.11,12.22 19.68,12.22 v20.48,11.43 | v26.19,16.99 26.51,16.99 v27.94,15.56 | v42.23,11.75 42.94,11.03 45.01,11.03 45.09,11.11 v45.09,11.27
  Bottom 0.61: v42.23,11.75 42.07,11.59 39.85,11.59 39.37,11.11 36.83,11.11 34.45,13.49 33.18,13.49 31.43,15.24 28.42,15.24 27.15,15.24 26.51,14.61 25.56,14.61 25.08,14.13 23.34,14.13 23.02,13.81
  Bottom 0.813: v4.45,20.95 8.57,16.83 8.57,11.27 9.22,10.62 v9.22,3.99 | v17.78,19.68 18.57,19.68 19.68,18.57 19.68,17.3 19.53,17.14 19.53,15.88 20.32,15.08 21.75,15.08 23.02,13.81 v23.02,13.65

### Text on the board
tNames: PB4 | PC5 | PC4 | PC3 | PC2 | PC0 | PC1 | ADC7 | ADC6 | PB1 | PB0